# Altium schematic sheet AMS1117.SchDoc
size A4
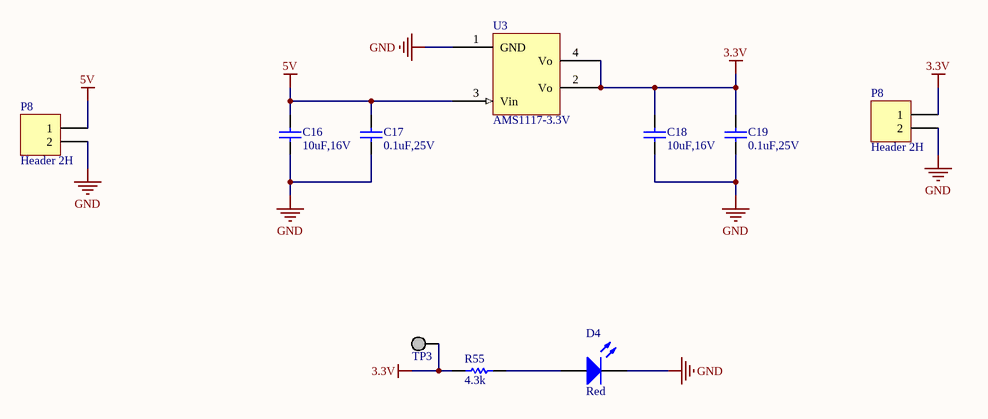
[diagram p0: AMS1117.SchDoc]

## Parts
(Parts that share a designator on the sheet are numbered #1, #2 ... from top to bottom, then left to right.)
C16  value 10uF,16V  [0603_C]  (hidden comment: Cap)
C17  value 0.1uF,25V  [0603_C]  (hidden comment: Cap)
C18  value 10uF,16V  [0603_C]  (hidden comment: Cap)
C19  value 0.1uF,25V  [0603_C]  (hidden comment: Cap)
D4  value Red  [0805_LED]  (hidden comment: LED)
P8#1  Header 2H  [KF2EDGK3.50H-2P]
P8#2  Header 2H  [KF2EDGK3.50H-2P]
R55  value 4.3k  [0603_R]  (hidden comment: Res_5%)
TP3  TP  [TP_H]  (value not drawn)  (no BOM)
U3  value AMS1117-3.3V  [SOT223]  (hidden comment: AMS1117)

## Nets
3.3V: C18.2 C19.2 P8#1.1 R55.2 TP3.1 U3.2(Vo) U3.4(Vo)
5V: C16.2 C17.2 P8#2.1 U3.3(Vin)
GND: C16.1 C17.1 C18.1 C19.1 D4.2(K) P8#1.2 P8#2.2 U3.1(GND)
NetD4_1: D4.1(A) R55.1

## Library data of the parts
C16 C18 = T_Cap_0603_10uF_16V_X5R: 贴片电容; Part Typer: X5R; Solder: SMD; Withstand Voltage: 16V; Tolerance: 10%; Schematic Path: X:\Database\Schematic Library.Schlib; Part Number: T_Cap_0603_10uF_16V_X5R; LibRef: T_Cap_0603_10uF_16V_X5R
C17 C19 = T_Cap_0603_0.1uF_25V_X5R: 贴片电容; Part Typer: X5R; Solder: SMD; Withstand Voltage: 25V; Tolerance: 10%; Schematic Path: X:\Database\Schematic Library.Schlib; Part Number: T_Cap_0603_0.1uF_25V_X5R; LibRef: T_Cap_0603_0.1uF_25V_X5R
D4 = T_LED_Red_0805: 红色LED灯; Solder: SMD; Schematic Path: X:\Database\Schematic Library.Schlib; Part Number: T_LED_Red_0805; LibRef: T_LED_Red_0805
P8#1 P8#2 = Header 2H: Header, 2-Pin, Right Angle; LatestRevisionDate: 17-Jul-2002; LatestRevisionNote: Re-released for DXP Platform.; Publisher: Altium Limited
R55 = T_Res_0603_4.3k_5%_1/10W: 贴片电阻; Solder: SMD; Power: 1/10W; Tolerance: 5%; Schematic Path: X:\Database\Schematic Library.Schlib; Part Number: T_Res_0603_4.3k_5%_1/10W; LibRef: T_Res_0603_4.3k_5%_1/10W
TP3 = T_TestPoint_H: 测试点_过孔; Solder: DIP; Schematic Path: X:\Database\Schematic Library.Schlib; Part Number: T_TestPoint_H; LibRef: T_TestPoint_H
U3 = T_AMS1117-3.3V: 电源芯片; Solder: SMD; Schematic Path: X:\Database\Schematic Library.Schlib; Part Number: T_AMS1117-3.3V; LibRef: T_AMS1117-3.3V; ComponentLink2Description: Datasheet; ComponentLink2URL: X:\Database\Datasheet\AMS1117.pdf